# EAGLE schematic bitfur_adapter (EAGLE 6.4)
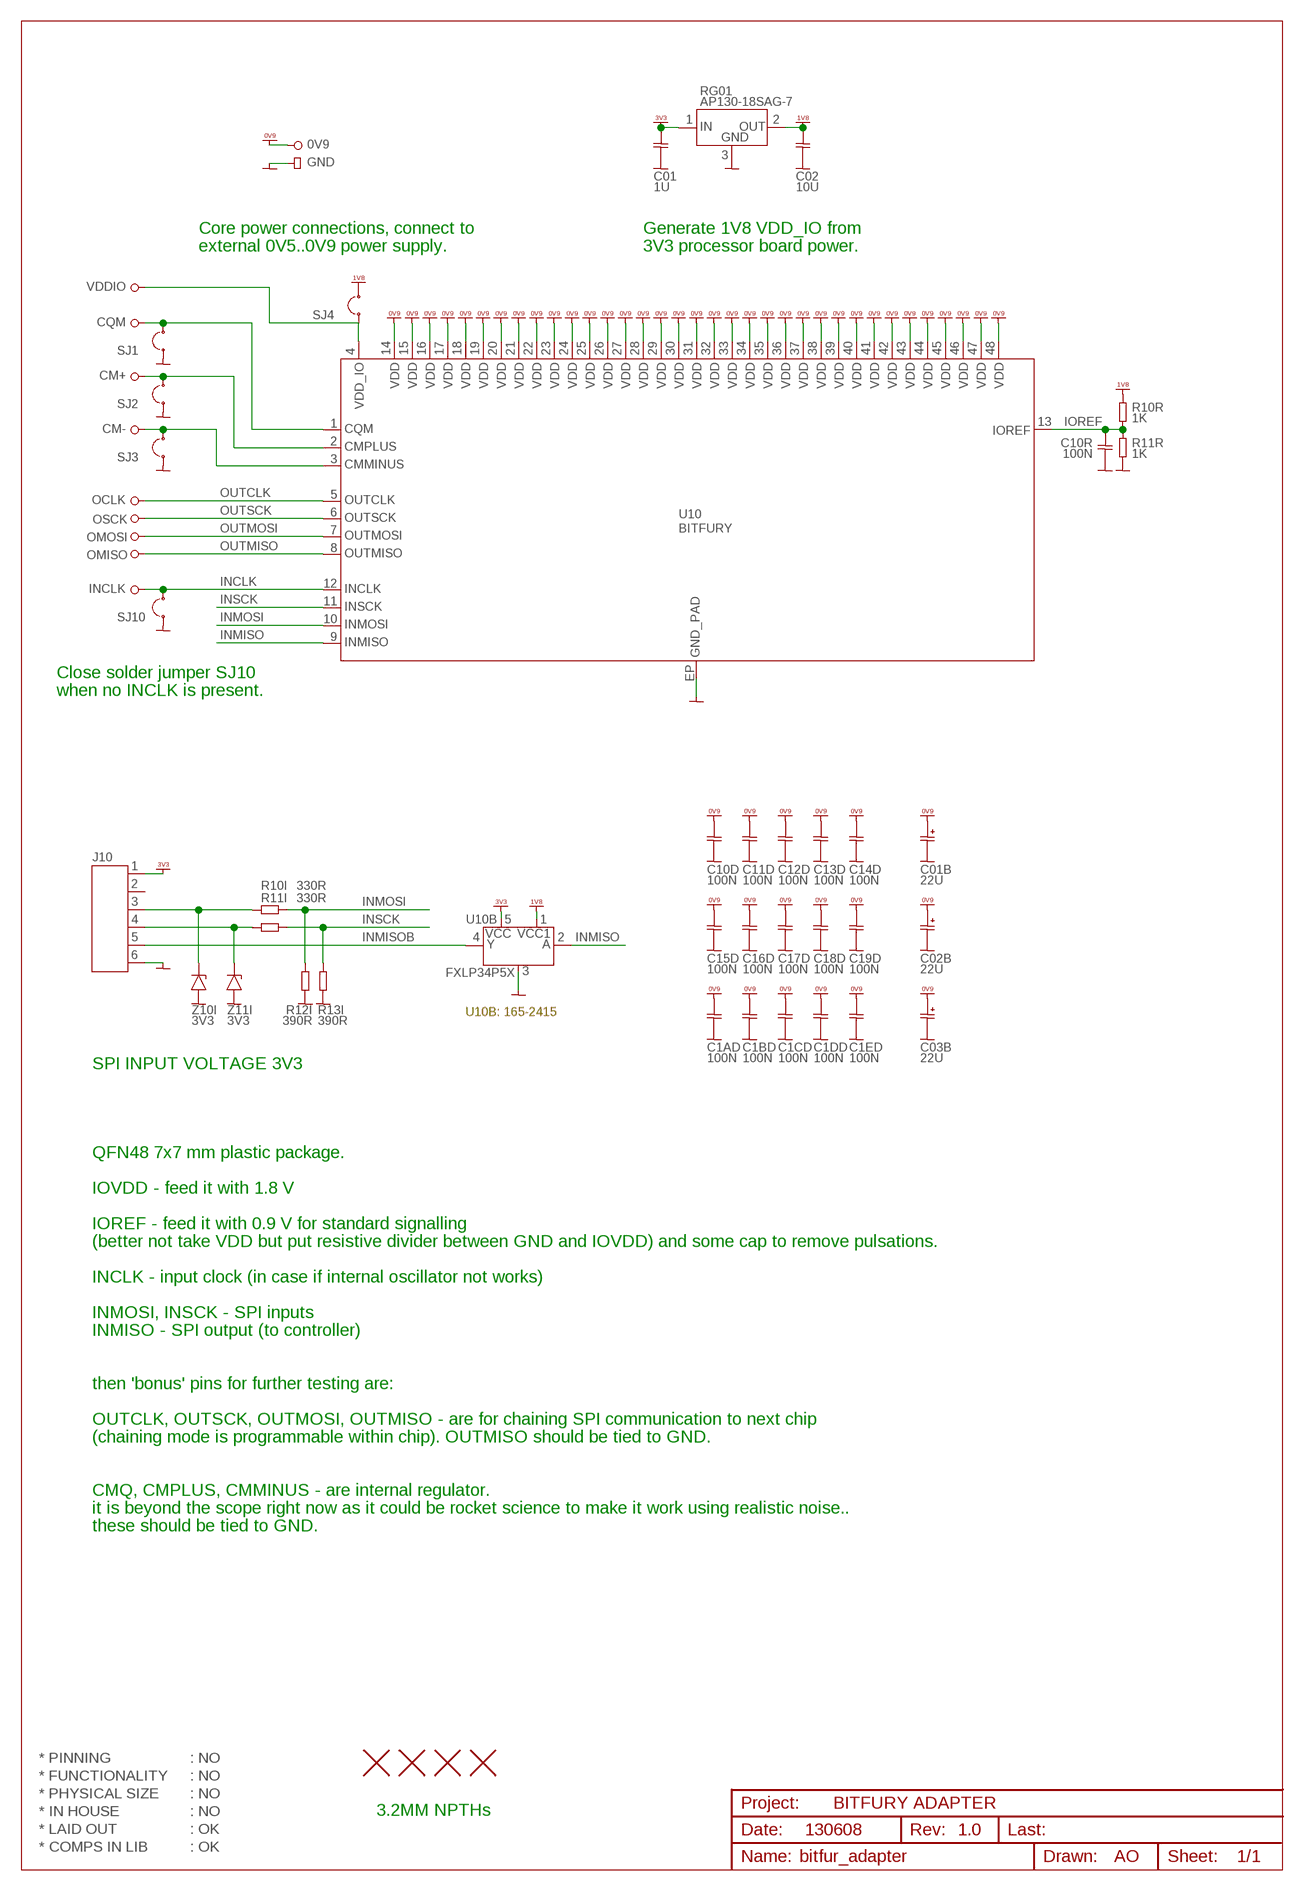
[diagram p0: schematic, sheet 1]

## Parts
0V9  PIN_TEST_BIG  [PAD_HOLE_BIG]
C01  1U  CAP0603  [CAP0603]
C1AD  100N  CAP0402  [CAP0402]
C01B  22U  ECAP_SMA  [ECAP_SMA]
C1BD  100N  CAP0402  [CAP0402]
C1CD  100N  CAP0402  [CAP0402]
C1DD  100N  CAP0402  [CAP0402]
C1ED  100N  CAP0402  [CAP0402]
C02  10U  CAP0603  [CAP0603]
C02B  22U  ECAP_SMA  [ECAP_SMA]
C03B  22U  ECAP_SMA  [ECAP_SMA]
C10D  100N  CAP0402  [CAP0402]
C10R  100N  CAP0402  [CAP0402]
C11D  100N  CAP0402  [CAP0402]
C12D  100N  CAP0402  [CAP0402]
C13D  100N  CAP0402  [CAP0402]
C14D  100N  CAP0402  [CAP0402]
C15D  100N  CAP0402  [CAP0402]
C16D  100N  CAP0402  [CAP0402]
C17D  100N  CAP0402  [CAP0402]
C18D  100N  CAP0402  [CAP0402]
C19D  100N  CAP0402  [CAP0402]
CM+  PIN_TEST  [PAD_HOLE_0.8MM]
CM-  PIN_TEST  [PAD_HOLE_0.8MM]
CQM  PIN_TEST  [PAD_HOLE_0.8MM]
H1  HOLE_NPTH_3.2MM  [HOLE_NPTH_3.2MM]
H2  HOLE_NPTH_3.2MM  [HOLE_NPTH_3.2MM]
H3  HOLE_NPTH_3.2MM  [HOLE_NPTH_3.2MM]
H4  HOLE_NPTH_3.2MM  [HOLE_NPTH_3.2MM]
INCLK  PIN_TEST  [PAD_HOLE_0.8MM]
J10  CON_MICROMATCH_6F-TOP  [CON_MICROMATCH_TOP_6F]
OCLK  PIN_TEST  [PAD_HOLE_0.8MM]
OMISO  PIN_TEST  [PAD_HOLE_0.8MM]
OMOSI  PIN_TEST  [PAD_HOLE_0.8MM]
OSCK  PIN_TEST  [PAD_HOLE_0.8MM]
R10I  330R  RES0603  [RES0603]
R10R  1K  RES0402  [RES0402]
R11I  330R  RES0603  [RES0603]
R11R  1K  RES0402  [RES0402]
R12I  390R  RES0603  [RES0603]
R13I  390R  RES0603  [RES0603]
RG01  AP130-18SAG-7  [SOT23]
SJ1  SJ2SJ2-S  [SJ2-S]
SJ2  SJ2SJ2-S  [SJ2-S]
SJ3  SJ2SJ2-S  [SJ2-S]
SJ4  SJ2SJ2-S  [SJ2-S]
SJ10  SJ2SJ2-S  [SJ2-S]
U10  BITFURY  [QNF48]
U10B  FXLP34P5X  [SOT23-5]
U$83  PIN_GND  [PAD_HOLE_SQR_1.8MM]
VDDIO  PIN_TEST  [PAD_HOLE_0.8MM]
Z10I  3V3  ZENER_SOD123  [ZENER_SOD123]
Z11I  3V3  ZENER_SOD123  [ZENER_SOD123]

## Nets
GND: C01.2 C1AD.2 C01B.- C1BD.2 C1CD.2 C1DD.2 C1ED.2 C02.2 C02B.- C03B.- C10D.2 C10R.2 C11D.2 C12D.2 C13D.2 C14D.2 C15D.2 C16D.2 C17D.2 C18D.2 C19D.2 J10.6 R11R.2 R12I.1 R13I.1 RG01.3(3.GND) SJ1.1 SJ2.1 SJ3.1 SJ10.1 U10.EP(EP.VSS_EP) U10.V1(EP.VSS_EP) U10.V2(EP.VSS_EP) U10.V3(EP.VSS_EP) U10.V4(EP.VSS_EP) U10.V5(EP.VSS_EP) U10.V6(EP.VSS_EP) U10.V7(EP.VSS_EP) U10.V8(EP.VSS_EP) U10.V9(EP.VSS_EP) U10.V10(EP.VSS_EP) U10.V11(EP.VSS_EP) U10.V12(EP.VSS_EP) U10.V13(EP.VSS_EP) U10.V14(EP.VSS_EP) U10.V15(EP.VSS_EP) U10.V16(EP.VSS_EP) U10.V17(EP.VSS_EP) U10.V18(EP.VSS_EP) U10.V19(EP.VSS_EP) U10.V20(EP.VSS_EP) U10.V21(EP.VSS_EP) U10.V22(EP.VSS_EP) U10.V23(EP.VSS_EP) U10.V24(EP.VSS_EP) U10.V25(EP.VSS_EP) U10B.3(3.GND) U$83.1 Z10I.1(+) Z11I.1(+)
INCLK: INCLK.1 SJ10.2 U10.12(12.INCLK)
INMISO: U10.9(9.INMISO) U10B.2(2.A)
INMISOB: J10.5 U10B.4(4.Y)
INMOSI: R10I.2 R12I.2 U10.10(10.INMOSI)
INSCK: R11I.2 R13I.2 U10.11(11.INSCK)
IOREF: C10R.1 R10R.2 R11R.1 U10.13(13.IOREF)
N$1: J10.3 R10I.1 Z10I.2(-)
N$2: J10.4 R11I.1 Z11I.2(-)
N$5: CM-.1 SJ3.2 U10.3(3.CMMINUS)
N$6: CM+.1 SJ2.2 U10.2(2.CMPLUS)
N$7: CQM.1 SJ1.2 U10.1(1.QCM)
N$8: SJ4.1 U10.4(4.VDD_IO) VDDIO.1
OUTCLK: OCLK.1 U10.5(5.OUTCLK)
OUTMISO: OMISO.1 U10.8(8.OUTMISO)
OUTMOSI: OMOSI.1 U10.7(7.OUTMOSI)
OUTSCK: OSCK.1 U10.6(6.OUTSCK)
VDD_0V9: 0V9.1 C1AD.1 C01B.+ C1BD.1 C1CD.1 C1DD.1 C1ED.1 C02B.+ C03B.+ C10D.1 C11D.1 C12D.1 C13D.1 C14D.1 C15D.1 C16D.1 C17D.1 C18D.1 C19D.1 U10.14(14.VDD) U10.15(15.VDD) U10.16(16.VDD) U10.17(17.VDD) U10.18(18.VDD) U10.19(19.VDD) U10.20(20.VDD) U10.21(21.VDD) U10.22(22.VDD) U10.23(23.VDD) U10.24(24.VDD) U10.25(25.VDD) U10.26(26.VDD) U10.27(27.VDD) U10.28(28.VDD) U10.29(29.VDD) U10.30(30.VDD) U10.31(31.VDD) U10.32(32.VDD) U10.33(33.VDD) U10.34(34.VDD) U10.35(35.VDD) U10.36(36.VDD) U10.37(37.VDD) U10.38(38.VDD) U10.39(39.VDD) U10.40(40.VDD) U10.41(41.VDD) U10.42(42.VDD) U10.43(43.VDD) U10.44(44.VDD) U10.45(45.VDD) U10.46(46.VDD) U10.47(47.VDD) U10.48(48.VDD) ; supply symbol labelled VCC_0V9
VDD_1V8: C02.1 R10R.1 RG01.2(2.OUT) SJ4.2 U10B.1(1.VCC1) ; supply symbol labelled VCC_1V8
VDD_3V3: C01.1 J10.1 RG01.1(1.IN) U10B.5(5.VCC) ; supply symbol labelled VCC_3V3
Unconnected: J10.2

## Notes on the sheet
- GND
- Core power connections, connect to | Generate 1V8 VDD_IO from
- external 0V5..0V9 power supply. | 3V3 processor board power.
- Close solder jumper SJ10
- when no INCLK is present.
- U10B: 165-2415
- SPI INPUT VOLTAGE 3V3
- QFN48 7x7 mm plastic package.
- IOVDD - feed it with 1.8 V
- IOREF - feed it with 0.9 V for standard signalling
- (better not take VDD but put resistive divider between GND and IOVDD) and some cap to remove pulsations.
- INCLK - input clock (in case if internal oscillator not works)
- INMOSI, INSCK - SPI inputs
- INMISO - SPI output (to controller)
- then 'bonus' pins for further testing are:
- OUTCLK, OUTSCK, OUTMOSI, OUTMISO - are for chaining SPI communication to next chip
- (chaining mode is programmable within chip). OUTMISO should be tied to GND.
- CMQ, CMPLUS, CMMINUS - are internal regulator.
- it is beyond the scope right now as it could be rocket science to make it work using realistic noise..
- these should be tied to GND.
- * PINNING | : NO
- * FUNCTIONALITY | : NO
- * PHYSICAL SIZE | : NO
- BITFURY ADAPTER
- * IN HOUSE | : NO | 3.2MM NPTHs
- * LAID OUT | : OK | 130608 | 1.0
- * COMPS IN LIB | : OK

## Library data of the parts
0V9 = 00-own_parts:PIN_TEST_BIG: Pin, test, hole 1.8mm, pad 2.5mm
C01 C02 = 00-own_parts:CAP0603
C1AD C1BD C1CD C1DD C1ED C10D C10R C11D C12D C13D C14D C15D C16D C17D C18D C19D = 00-own_parts:CAP0402
C01B C02B C03B = 00-own_parts:ECAP_SMA: Capacitor, tantalum, case A (1206)
CM+ CM- CQM INCLK OCLK OMISO OMOSI OSCK VDDIO = 00-own_parts:PIN_TEST
H1-H4 = 00-own_parts:HOLE_NPTH_3.2MM: Hole, NPTH, 3.2mm
J10 = 00-own_parts:CON_MICROMATCH_6F: Connector, PCB, micromatch, female, 6p, F# 148-519
R10I R10R R11I R11R R12I R13I = 00-own_parts:RES
RG01 = 00-bitfury:AP130-18SAG-7: Regulator, 300mA, Vdrop: 400mV, Vin_max: 5V5, Vout: 1V8, SOT23, F#182-5304
SJ1-SJ4 SJ10 = 00-own_parts:SJ2
U10 = 00-bitfury:BITFURY: MCU, Bitfury SHA256 Bitcoin hasher, 5GH/s, QNF48
U10B = 00-bitfury:FXLP34P5X: Buffer, level shifting, single gate, SOT23-5, F#165-2415
U$83 = 00-own_parts:PIN_GND
Z10I Z11I = 00-own_parts:ZENER_SOD123